# Altium schematic sheet POWER.SchDoc
size A4; SheetNumber: 2; SheetTotal: 5
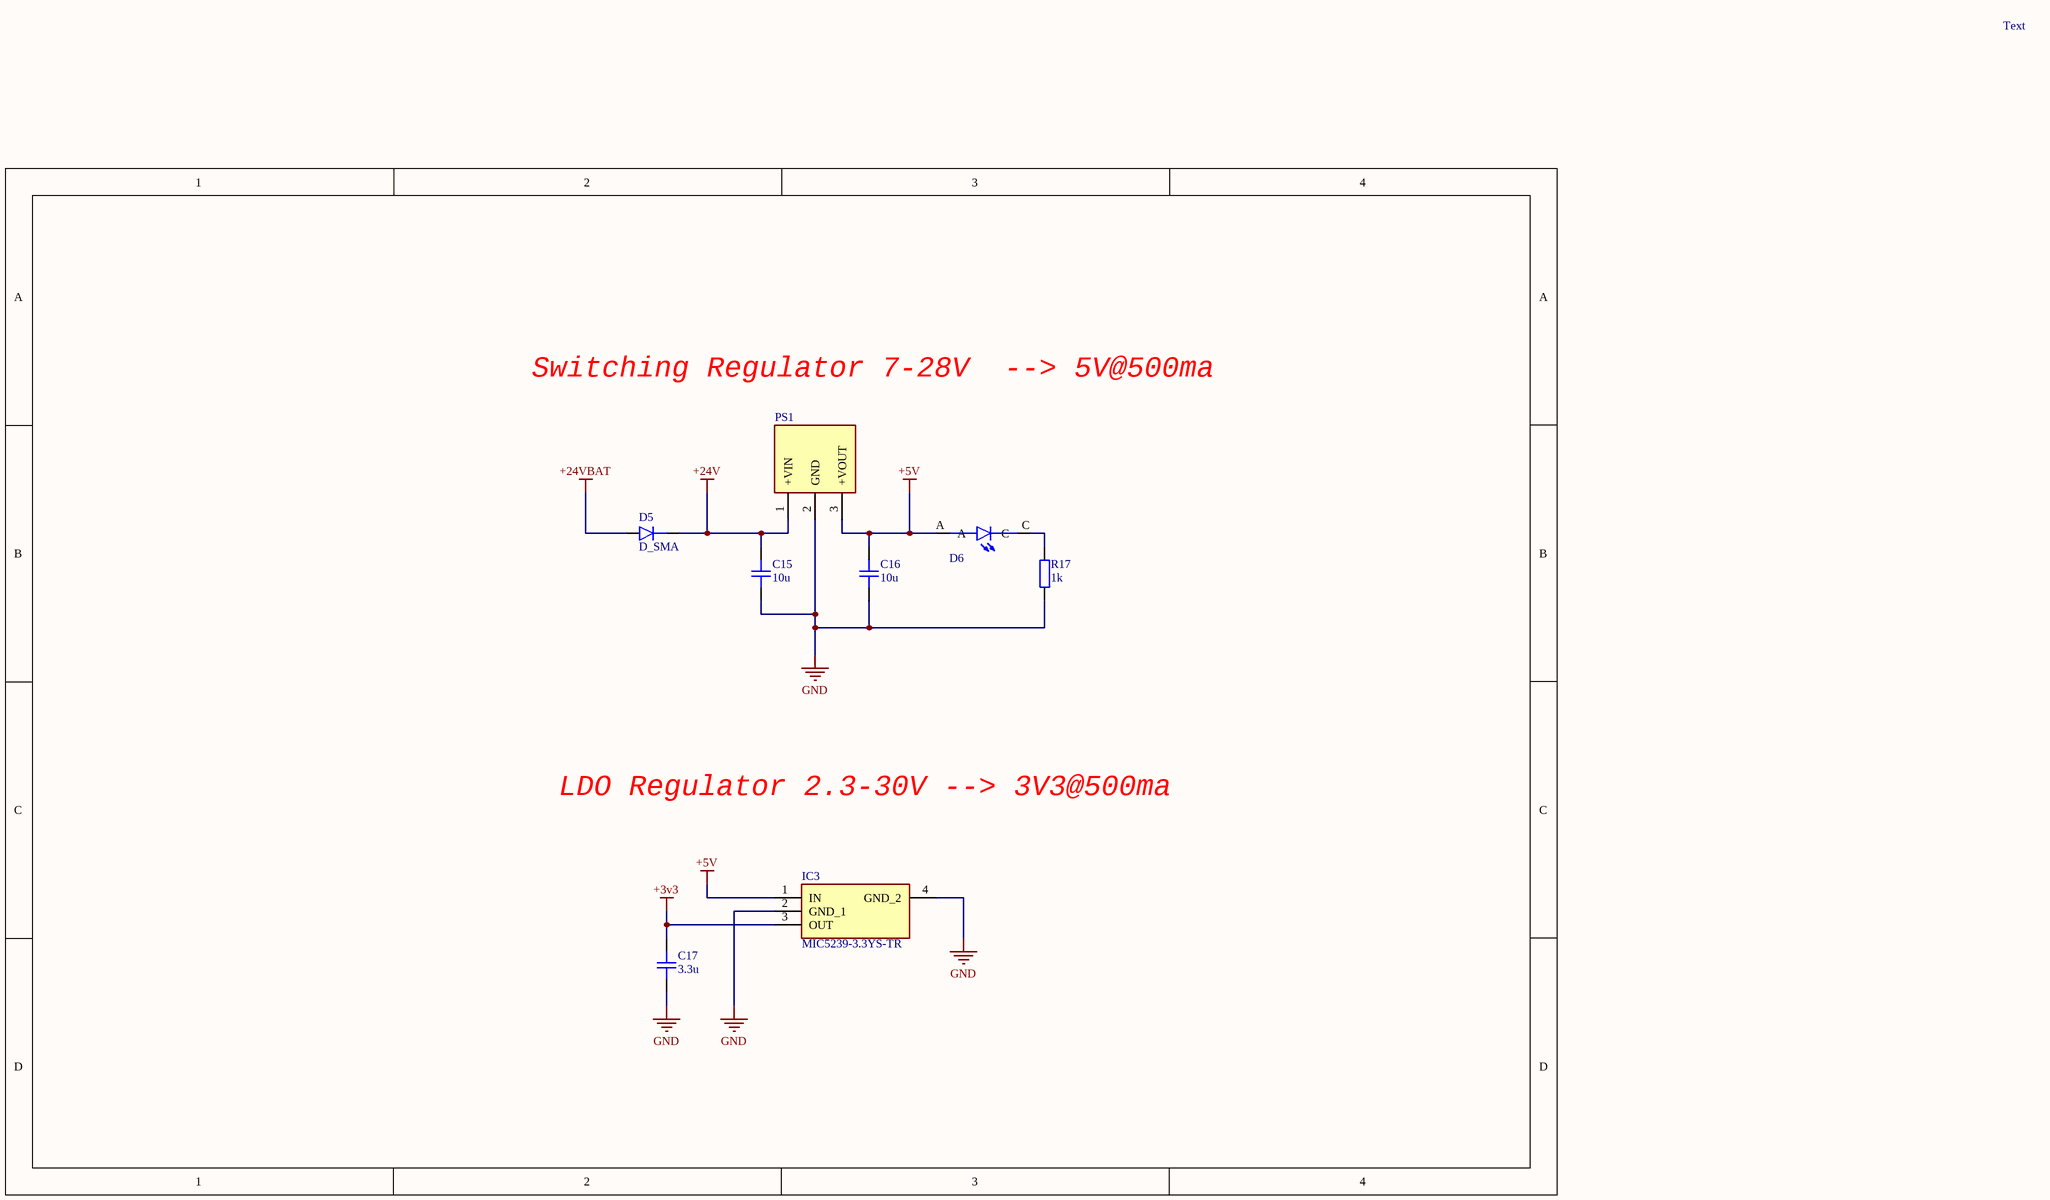
[diagram p0: POWER.SchDoc]

## Parts
C15  10u  [CAP_0805]
C16  10u  [CAP_0805]
C17  3.3u  [CAP_0805]
D5  D_SMA  [DO-214AC-2 (SMA)]
D6  SML-LXT0805IW-TR  [LEDC2012X120N]  (value not drawn)
IC3  MIC5239-3.3YS-TR  [SOT230P700X180-4N]
PS1  R-78E5.0-0.5  [R78E5005]  (value not drawn)
R17  1k  [RES_0805]

## Nets
+3v3: C17.2 IC3.3(OUT)
+5V: C16.2 D6.A IC3.1(IN) PS1.3(+VOUT)
+24V: C15.2 D5.K PS1.1(+VIN)
+24VBAT: D5.A
GND: C15.1 C16.1 C17.1 IC3.2(GND_1) IC3.4(GND_2) PS1.2(GND) R17.2
NetD6_C: D6.C R17.1

## Notes on the sheet
- Text
- Switching Regulator 7-28V  --> 5V@500ma
- LDO Regulator 2.3-30V --> 3V3@500ma

## Library data of the parts
C15-C17 = CAP_0805_10V: Capacitor SMD 0805 10V
D5 = D_SMA: Diode SMD SMA (DO-214AA)
D6 = SML-LXT0805IW-TR: Red - LED Indication - Discrete 2V 0805 (2012 Metric); MF: Lumex Opto/Components; Check_prices: https://www.snapeda.com/parts/SML-LXT0805IW-TR/Lumex+Opto%252FComponents+Inc./view-part/?ref=eda; Price: None; MP: SML-LXT0805IW-TR; SnapEDA_Link: https://www.snapeda.com/parts/SML-LXT0805IW-TR/Lumex+Opto%252FComponents+Inc./view-part/?ref=snap; Availability: In Stock; Value: *; Purchase-URL: https://pricing.snapeda.com/search/part/SML-LXT0805IW-TR/?ref=eda; Package: 0805 Lumex
IC3 = MIC5239-3.3YS-TR: Integrated Circuit; Manufacturer_Name: Microchip; Datasheet Link: https://ww1.microchip.com/downloads/en/DeviceDoc/mic5239.pdf; Height: 1.8mm; Manufacturer_Part_Number: MIC5239-3.3YS-TR; Mouser Part Number: 998-MIC5239-3.3YSTR; Mouser Price/Stock: https://www.mouser.co.uk/ProductDetail/Microchip-Technology-Micrel/MIC5239-33YS-TR?qs=U6T8BxXiZAXN0UitWWB92A%3D%3D; Arrow Part Number: MIC5239-3.3YS-TR; Arrow Price/Stock: https://www.arrow.com/en/products/mic5239-3.3ys-tr/microchip-technology?region=nac
PS1 = R-78E5.0-0.5: Power Supply; Manufacturer_Name: RECOM Power; Datasheet Link: https://datasheet.datasheetarchive.com/originals/distributors/Datasheets_SAMA/1560217c2d38d5ce10907af13420fc49.pdf; Height: 10.9mm; Manufacturer_Part_Number: R-78E5.0-0.5; Mouser Part Number: 919-R-78E5.0-0.5; Mouser Price/Stock: https://www.mouser.co.uk/ProductDetail/RECOM-Power/R-78E5.0-0.5?qs=JeAkOuORR2UvBuiB2kZVZQ%3D%3D; Arrow Part Number: R-78E5.0-0.5; Arrow Price/Stock: https://www.arrow.com/en/products/r-78e5.0-0.5/recom-power?region=europe
R17 = RES_0805: Resistor SMD 0805